# EAGLE design CD_brains (EAGLE 7.2.0)
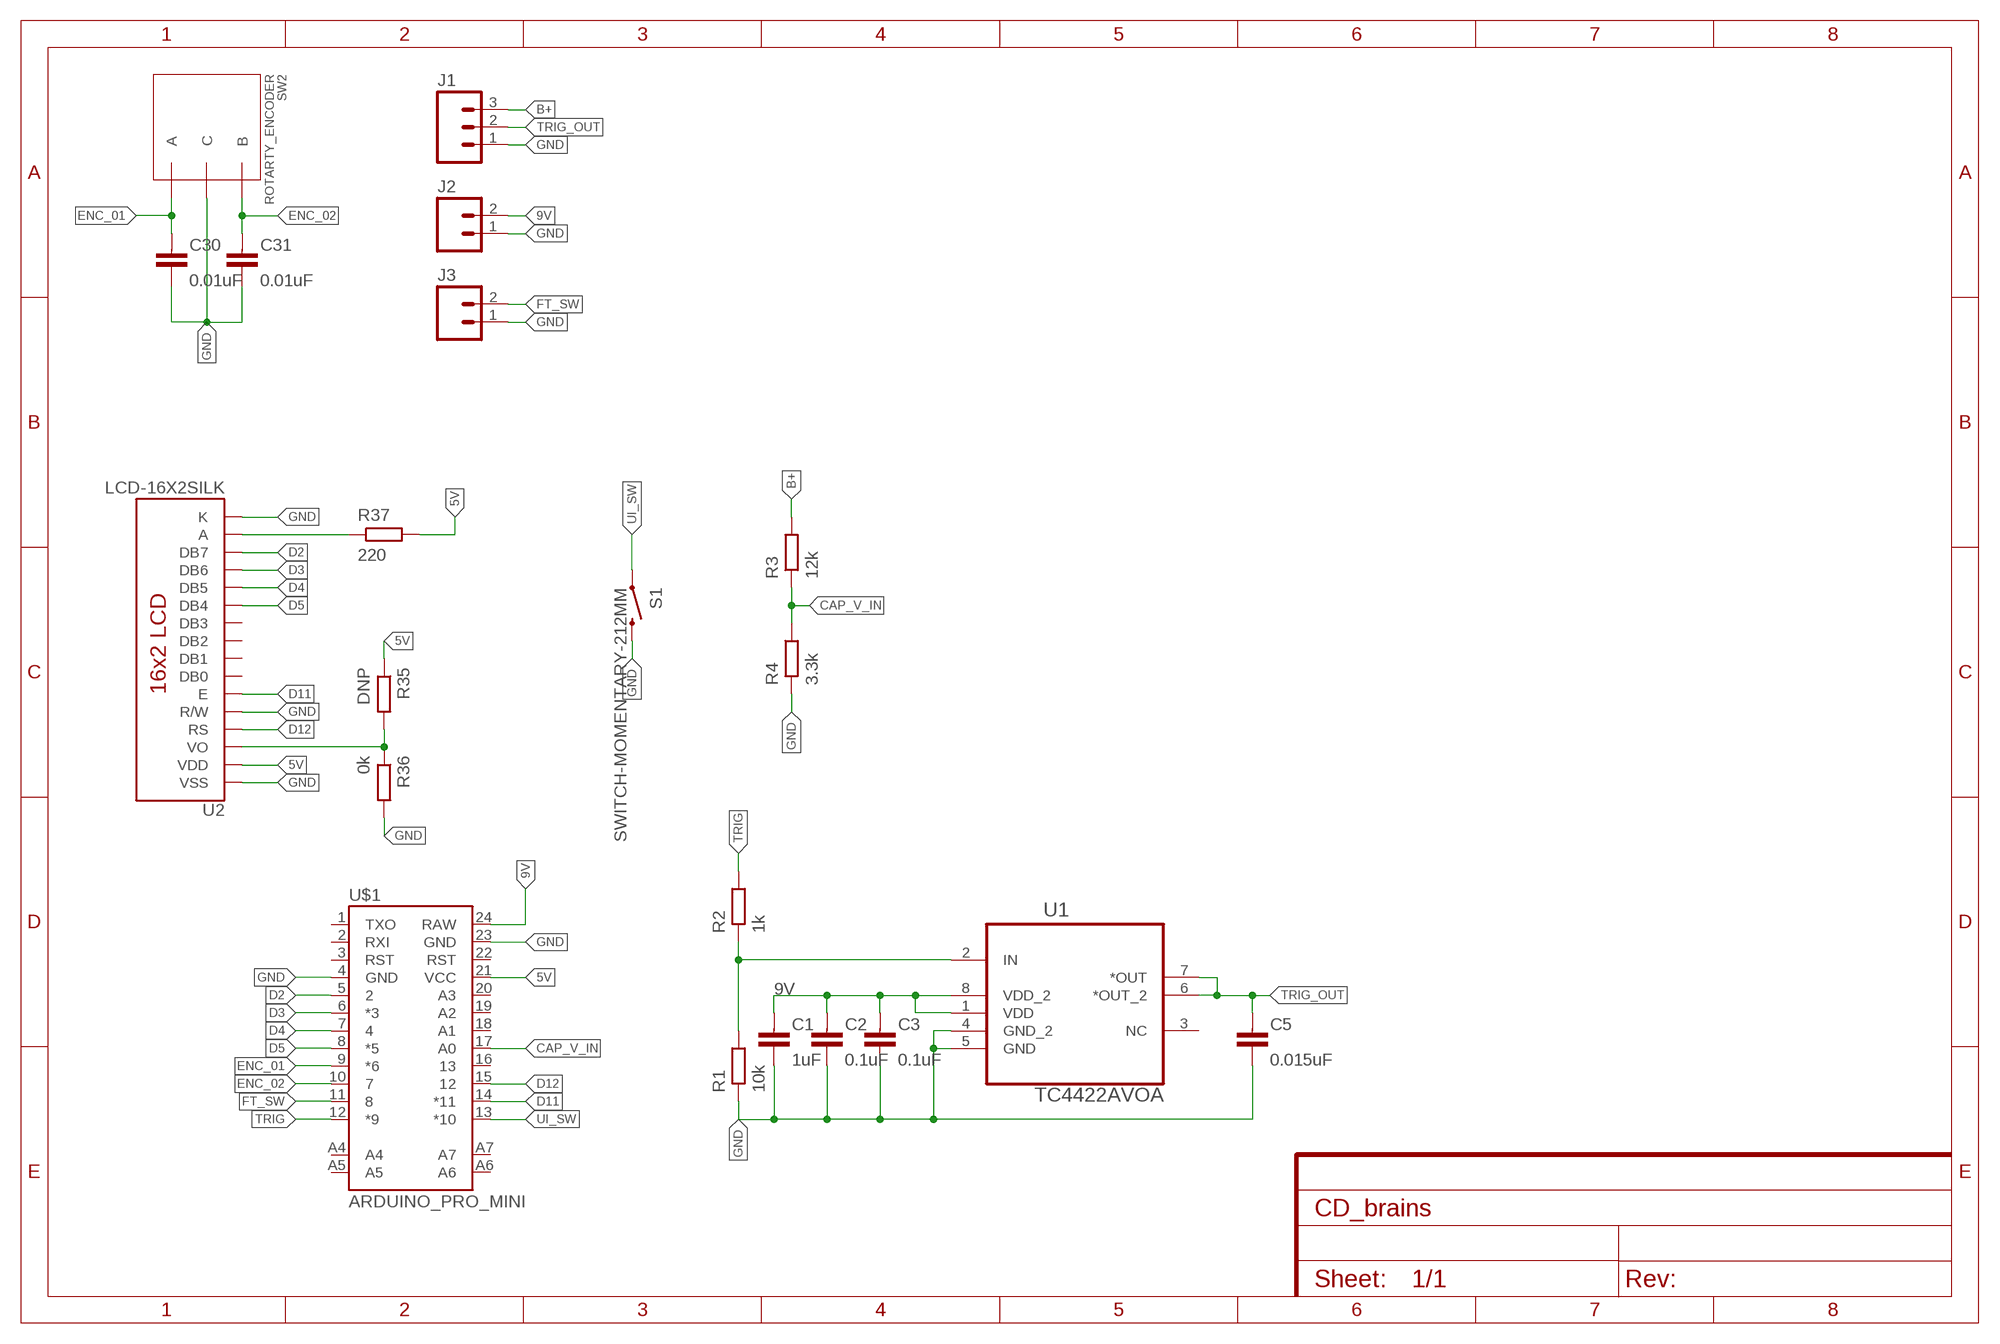
[diagram p0: schematic, sheet 1]

## Parts
C1  1uF  CAPACITOR0805-N  [C0805-N]
C2  0.1uF  CAPACITOR0603-N  [C0603-N]
C3  0.1uF  CAPACITOR0603-N  [C0603-N]
C5  0.015uF  CAPACITOR0603-N  [C0603-N]
C30  0.01uF  CAPACITOR0603-N  [C0603-N]
C31  0.01uF  CAPACITOR0603-N  [C0603-N]
J1  M03LOCK_NO_SILK  [1X03_LOCK_NO_SILK]
J2  M02LOCK  [1X02_LOCK]
J3  M02LOCK  [1X02_LOCK]
R1  10k  RESISTOR0603-N  [R0603-N]
R2  1k  RESISTOR0603-N  [R0603-N]
R3  12k  RESISTOR0603-N  [R0603-N]
R4  3.3k  RESISTOR0603-N  [R0603-N]
R35  DNP  RESISTOR0603-N  [R0603-N]
R36  0k  RESISTOR0603-N  [R0603-N]
R37  220  RESISTOR0603-N  [R0603-N]
S1  SWITCH-MOMENTARY-212MM  [TACTILE-PTH-12MM]
SW2  ROTARTY_ENCODER  [ROTARY_ENC_PLAIN]
U1  TC4422AVOA  [SOIC127P600X175-8N]
U2  LCD-16X2SILK  [LCD-16X2]
U$1  ARDUINO_PRO_MINI  [ARDUINO_PRO_MINI]

## Nets
5V: R35.1 R37.2 U2.2(VDD) U$1.21(VCC)
9V: C1.1 C2.1 C3.1 J2.2 U1.1(VDD) U1.8(VDD_2) U$1.24(RAW)
B+: J1.3 R3.2
CAP_V_IN: R3.1 R4.2 U$1.17(A0)
D2: U2.14(DB7) U$1.5
D3: U2.13(DB6) U$1.6(*3)
D4: U2.12(DB5) U$1.7
D5: U2.11(DB4) U$1.8(*5)
D11: U2.6(E) U$1.14(*11)
D12: U2.4(RS) U$1.15
ENC_01: C30.1 SW2.A U$1.9(*6)
ENC_02: C31.1 SW2.B U$1.10
FT_SW: J3.2 U$1.11
GND: C1.2 C2.2 C3.2 C5.2 C30.2 C31.2 J1.1 J2.1 J3.1 R1.1 R4.1 R36.2 S1.3 SW2.C U1.4(GND_2) U1.5(GND) U2.1(VSS) U2.5(R/W) U2.16(K) U$1.4(GND) U$1.23(GND)
N$3: R1.2 R2.1 U1.2(IN)
N$17: R37.1 U2.15(A)
N$28: R35.2 R36.1 U2.3(VO)
TRIG: R2.2 U$1.12(*9)
TRIG_OUT: C5.1 J1.2 U1.6(*OUT_2) U1.7(*OUT)
UI_SW: S1.1 U$1.13(*10)
Unconnected: U1.3(NC) U2.7(DB0) U2.8(DB1) U2.9(DB2) U2.10(DB3) U$1.1(TXO) U$1.2(RXI) U$1.3(RST) U$1.16 U$1.18(A1) U$1.19(A2) U$1.20(A3) U$1.22(RST) U$1.A4 U$1.A5 U$1.A6 U$1.A7

## Library data of the parts
C1-C3 C5 C30 C31 = passives-7351:CAPACITOR
J1 = SparkFun-Connectors:M03: Header 3 Standard 3-pin 0.1" header. Use with straight break away headers (SKU : PRT-00116), right angle break away headers (PRT-00553), swiss pins (PRT-00743), machine pins (PRT-00117), and female headers (PRT-00115). Molex polarized connector foot print use with SKU : PRT-08232 with associated crimp pins and housings.
J2 J3 = SparkFun-Connectors:M02: Standard 2-pin 0.1" header. Use with - straight break away headers ( PRT-00116) - right angle break away headers (PRT-00553) - swiss pins (PRT-00743) - machine pins (PRT-00117) - female headers (PRT-00115) Molex polarized connector foot print use with: PRT-08233 with associated crimp pins and housings. 2.54_SCREWTERM for use with PRT-10571. 3.5mm Screw Terminal footprints for PRT-08084 5mm Screw Terminal footprints for use with PRT-08432
R1-R4 R35-R37 = passives-7351:RESISTOR
S1 = SparkFun-Electromechanical:SWITCH-MOMENTARY-2: Various NO switches- pushbuttons, reed, etc; PROD_ID: SWCH-09185
SW2 = _my-parts:ROTARTY_ENCODER: Simple no LED rotary encoder Example: COM-09117
U1 = Microchip_By_element14_Batch_1:TC4422AVOA: DRIVER, MOSFET, SINGL 9A,; MPN: TC4422AVOA; OC_FARNELL: 1332306; OC_NEWARK: 22K2735; PACKAGE: 8 - SOIC; SUPPLIER: Microchip
U2 = SparkFun-Displays:LCD-16X2: Standard text-only 16x2 parallel input LCD
U$1 = _my-parts:ARDUINO_PRO_MINI

## Board
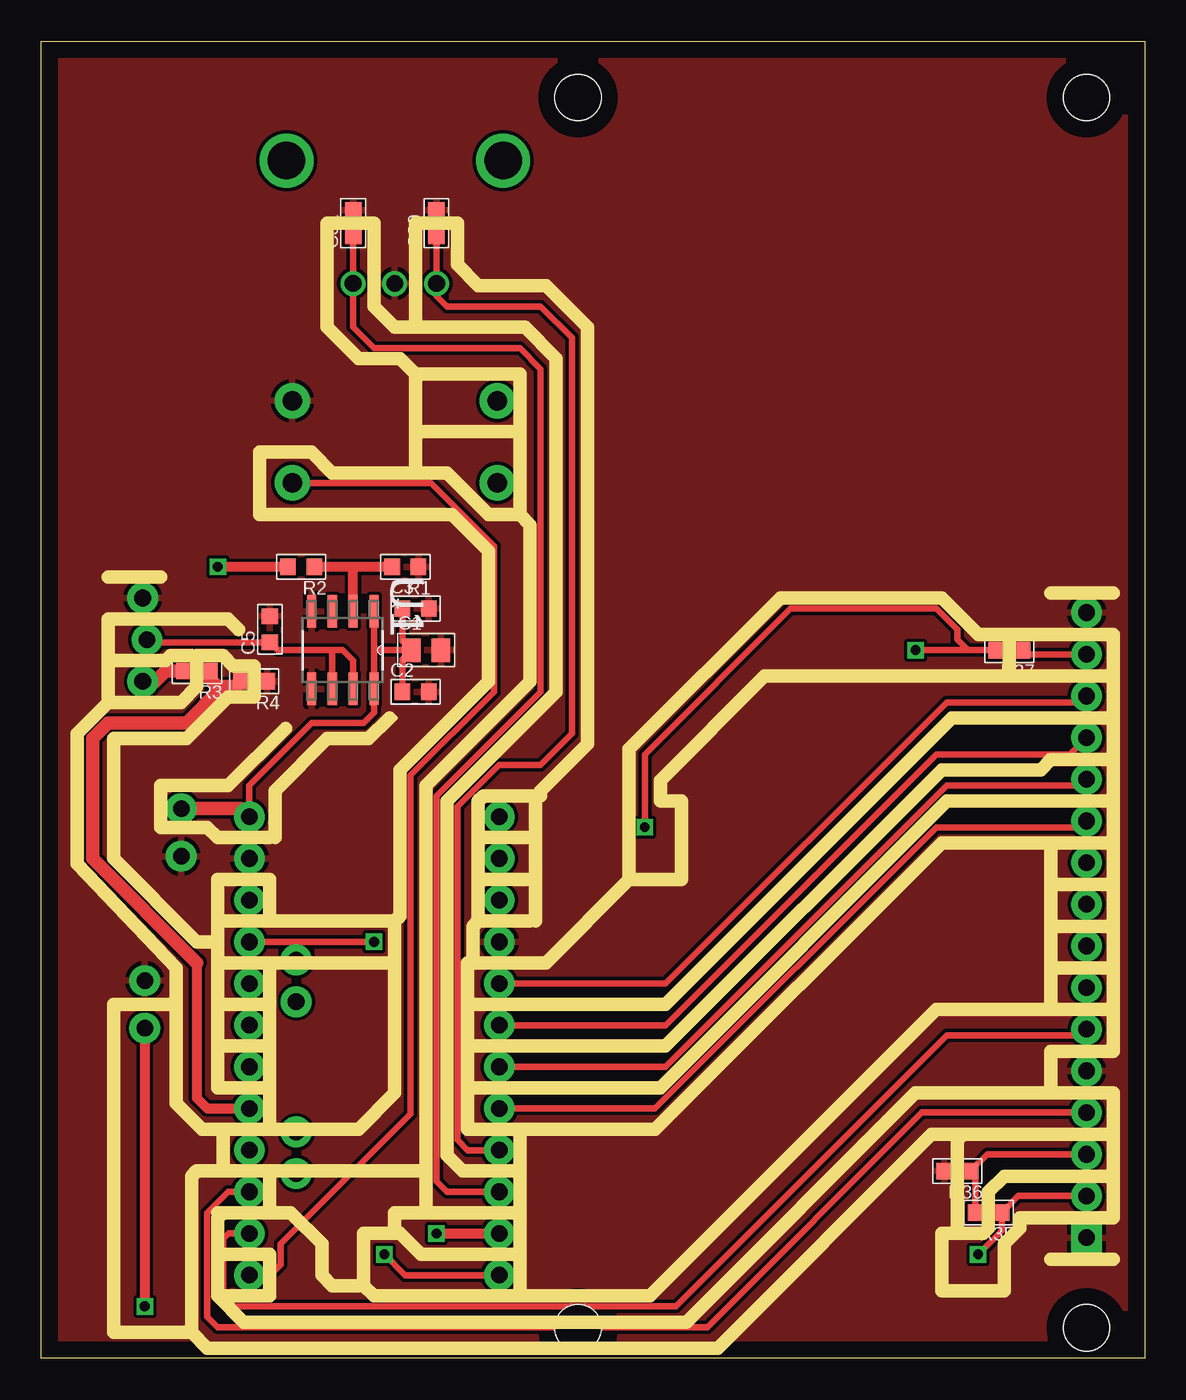
[diagram p1: board, top side]
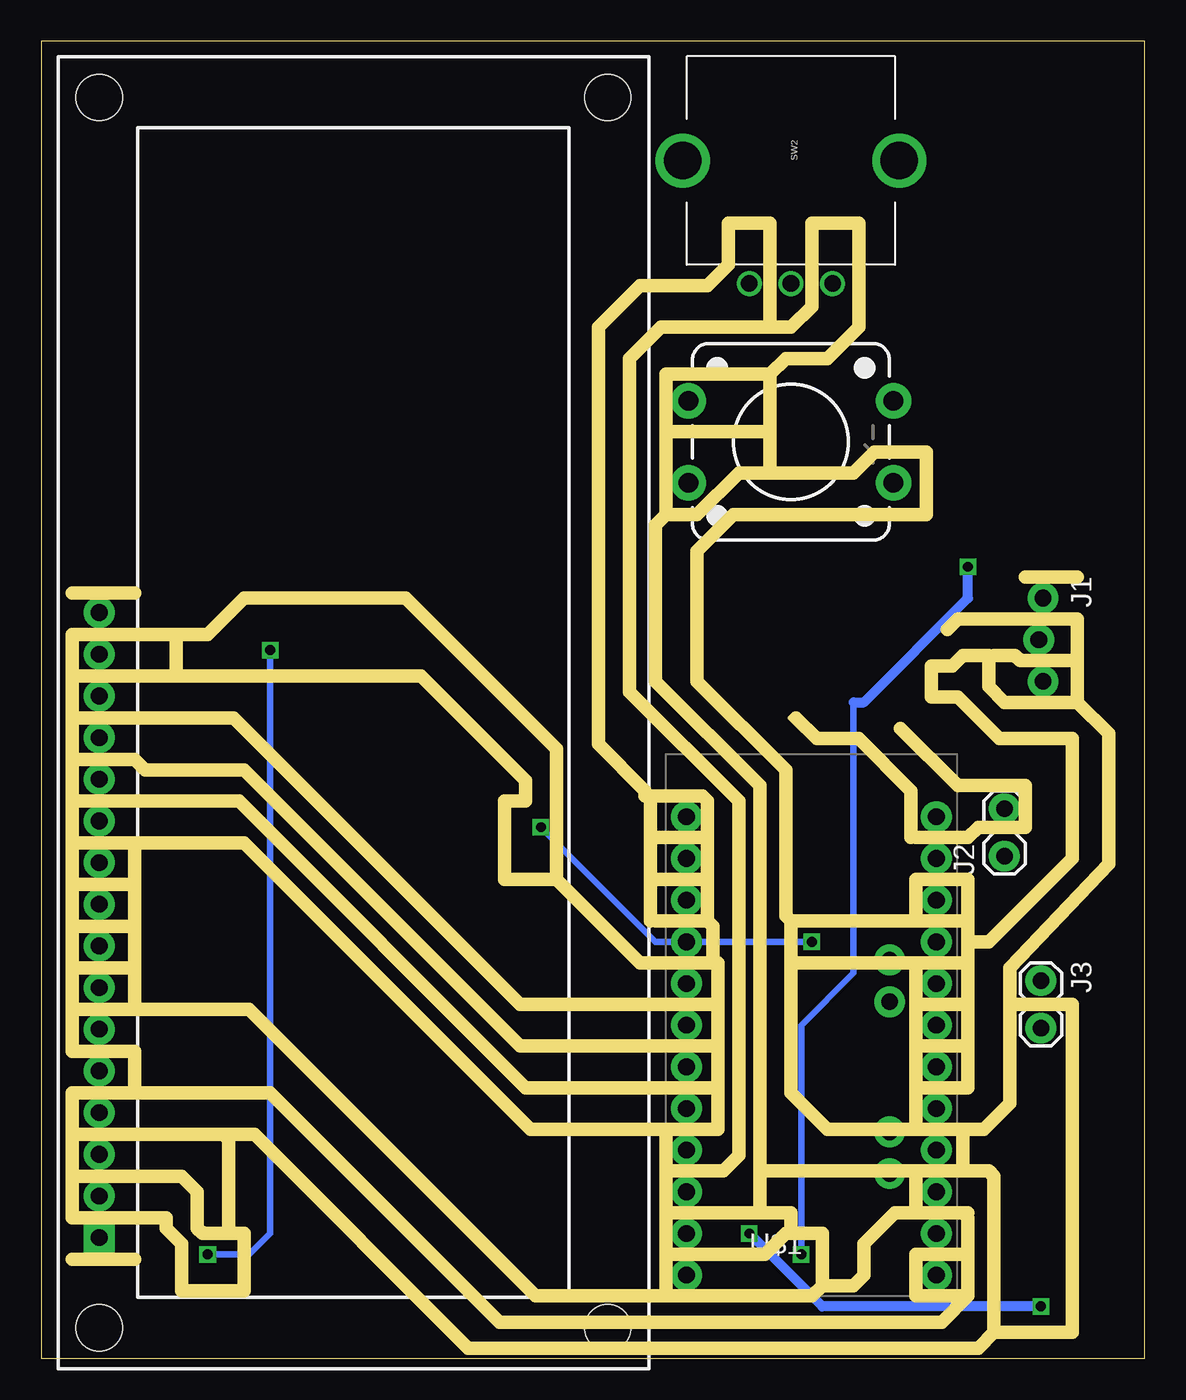
[diagram p2: board, bottom side, seen from below]

Size 67.29 x 80.31 mm. Coordinates in mm from the lower left corner, seen from the top.
Outline: 67.29,0 0,0 0,80.31 67.29,80.31 67.29,0
Copper layers (1*16): Top 0.035mm / dielectric 1.5mm / Bottom 0.035mm
Design rules "default": minimum track width 10mil, minimum drill 24mil, track to track 8mil, track to pad 8mil, pad to pad 8mil, via to via 8mil, smd to smd 8mil, copper to edge 40mil, drill to drill 8mil, minimum pad ring 10mil, minimum via ring 8mil, stop-mask expansion 4mil, vias tented up to drill 0mil, thermal gap 10mil
Milling: 218 lines

### Footprints (pad centres in the part's own frame; a part is rotated, then mirrored left to right if it is on the bottom)
C0805-N = smd 1.15 x 1.45: 1 -0.9,0; 2 0.9,0
C0603-N = smd 0.95 x 1: 1 -0.8,0; 2 0.8,0
1X03_LOCK_NO_SILK = drill 1.016 pad 1.88: 1 0,0.127; 2 2.54,-0.127; 3 5.08,0.127
1X02_LOCK = drill 1.016 pad 1.88: 1 -0.178,0; 2 2.718,0
R0603-N = smd 0.95 x 1: 1 -0.8,0; 2 0.8,0
TACTILE-PTH-12MM = drill 1.2 pad 2.159: 1 6.25,-2.5; 2 -6.25,-2.5; 3 6.25,2.5; 4 -6.25,2.5
ROTARY_ENC_PLAIN = drill 1.016: A 7.493,-2.54; B 7.493,2.54; C 7.493,0 | drill 2.286: P$3 0,6.604; P$4 0,-6.604
SOIC127P600X175-8N = smd 1.981 x 0.559: 1 -2.362,1.905; 2 -2.362,0.635; 3 -2.362,-0.635; 4 -2.362,-1.905; 5 2.362,-1.905; 6 2.362,-0.635; 7 2.362,0.635; 8 2.362,1.905
LCD-16X2 = drill 1.016 pad 1.88 square: 1 -32,15.5 | drill 1.016 pad 1.88: 2 -29.46,15.5; 3 -26.92,15.5; 4 -24.38,15.5; 5 -21.84,15.5; 6 -19.3,15.5; 7 -16.76,15.5; 8 -14.22,15.5; 9 -11.68,15.5; 10 -9.14,15.5; 11 -6.6,15.5; 12 -4.06,15.5; 13 -1.52,15.5; 14 1.02,15.5; 15 3.56,15.5; 16 6.1,15.5 | hole 2.8: -37.5,15.5; -37.5,-15.5; 37.5,15.5; 37.5,-15.5
ARDUINO_PRO_MINI = drill 1.016 pad 1.88: 1 -7.62,12.7; 2 -7.62,10.16; 3 -7.62,7.62; 4 -7.62,5.08; 5 -7.62,2.54; 6 -7.62,0; 7 -7.62,-2.54; 8 -7.62,-5.08; 9 -7.62,-7.62; 10 -7.62,-10.16; 11 -7.62,-12.7; 12 -7.62,-15.24; 13 7.62,-15.24; 14 7.62,-12.7; 15 7.62,-10.16; 16 7.62,-7.62; 17 7.62,-5.08; 18 7.62,-2.54; 19 7.62,0; 20 7.62,2.54; 21 7.62,5.08; 22 7.62,7.62; 23 7.62,10.16; 24 7.62,12.7; A4 4.763,1.429; A5 4.763,3.969; A6 4.763,-9.049; A7 4.763,-6.509

### Placement (x,y rotation side)
C1  23.48,43.18 0 top
C2  22.84,40.64 0 top
C3  22.84,45.72 0 top
C5  13.95,44.45 90 top
C30  24.11,69.22 90 top
C31  19.03,69.22 90 top
J1  6.33,46.35 270 bottom
J2  8.55,30.8 90 bottom
J3  6.33,22.86 270 bottom
R1  22.21,48.26 180 top
R2  15.86,48.26 180 top
R3  9.51,41.91 180 top
R4  13,41.27 180 top
R35  57.77,8.89 180 top
R36  55.86,11.43 180 top
R37  59.03,43.18 180 top
S1  21.57,55.88 0 bottom
SW2  21.57,73.03 270 bottom
U1  18.4,43.18 270 top
U2  48.24,39.37 90 bottom
U$1  20.32,20.32 0 bottom

### Tracks (layer width: path | path; a pad name or v marks a point on that pad's centre or on a via)
5V  (via drill 0.6)
  Top 0.406: U2.2 59.59,9.91 R35.1 58.57,7.79 v57.13,6.35 | v53.32,43.18 R37.2 56.5,43.18 55.86,43.81 55.86,44.45 54.59,45.72 45.7,45.72 36.81,36.83 v36.81,32.38 | v20.3,25.4 U$1.21 12.68,25.4
  Bottom 0.406: v57.13,6.35 54.59,6.35 53.32,7.62 v53.32,43.18 | v20.3,25.4 29.83,25.4 v36.81,32.38
9V
  Top 0.406: 20.3,43.18 U1.8 20.3,39.37 19.67,38.73 16.49,38.73 12.68,34.92 12.68,33.02 U$1.24 | C2.1 22.04,42.65 C1.1 | C3.1 22.04,43.72 C1.1 | U1.1 20.3,43.18 | 20.3,43.18 C1.1
  Top 0.813: J2.2 12.18,33.52 12.68,33.02
B+
  Top 0.813: J1.3 6.97,41.27 7.6,41.91 R3.2
CAP_V_IN
  Top 0.406: U$1.17 12.68,15.24
  Top 0.61: 12.68,15.24 10.14,15.24 9.51,15.88 9.51,24.13
  Top 0.813: 9.51,24.13 3.16,30.48 3.16,37.78 4.11,38.73 8.87,38.73 10.93,40.8 | 10.93,40.8 11.09,40.96 11.88,40.96 R4.2 | R3.1 10.31,41.43 10.93,40.8
D2
  Top 0.406: U2.14 63.36,40.01 55.23,40.01 38.08,22.86 U$1.5 27.92,22.86
D3
  Top 0.406: 27.92,20.32 U$1.6 28.26,20.32 38.08,20.32 54.59,36.83 62.72,36.83 U2.13
D4
  Top 0.406: U2.12 63.36,34.92 55.23,34.92 38.08,17.78 U$1.7 27.92,17.78
D5
  Top 0.406: 27.92,15.24 U$1.8 28.26,15.24 37.45,15.24 54.59,32.38 63.36,32.38 U2.11
D11
  Top 0.406: U2.6 63.36,19.68 55.23,19.68 38.72,3.17 11.75,3.17 11.11,3.81 11.11,7.3 11.43,7.62 U$1.14
D12
  Top 0.406: U2.4 53.71,14.99 40.62,1.91 10.78,1.91 10.14,2.54 10.14,8.89 11.41,10.16 U$1.15
ENC_01
  Top 0.406: C30.1 SW2.A 24.11,64.77 24.75,64.14 30.46,64.14 32.37,62.23 32.37,38.1 30.46,36.2 27.92,36.2 25.38,33.66 25.38,13.34 26.02,12.7 U$1.9
ENC_02
  Top 0.406: C31.1 SW2.B 19.03,62.87 20.3,61.59 29.19,61.59 30.46,60.33 30.46,40.64 24.11,34.29 24.11,10.79 24.75,10.16 U$1.10
FT_SW  (via drill 0.6)
  Top 0.406: 27.92,7.62 U$1.11
  Top 0.61: J3.2 v6.33,3.17 | v24.11,7.62 27.92,7.62
  Bottom 0.61: v6.33,3.17 19.67,3.17 v24.11,7.62
GND
  pour Top: 67.29,0 -0.02,0 -0.02,80.01 67.29,80.01
N$3
  Top 0.61: U1.2 19.03,48.26 | 19.03,48.26 R2.1 | R1.2 19.03,48.26
N$17
  Top 0.406: U2.15 60.09,42.93 R37.1
N$28
  Top 0.406: U2.3 57.68,12.45 R36.1 56.97,11.12 R35.2
TRIG  (via drill 0.6)
  Top 0.406: U$1.12 22.21,5.08 v20.94,6.35
  Top 0.61: R2.2 v10.78,48.26
  Bottom 0.406: v20.94,6.35 20.94,20.32 17.76,23.5 17.76,40.01
  Bottom 0.61: 17.76,40.01 17.13,40.01 10.78,46.35 v10.78,48.26
TRIG_OUT
  Top 0.406: U1.7 19.03,42.55 18.4,43.18 17.76,43.18 | 17.76,43.18 14.42,43.18 C5.1 6.67,43.65 J1.2 | U1.6 17.76,43.18
UI_SW
  Top 0.406: S1.1 23.77,53.38 27.62,49.53 27.62,40.64 22.54,35.56 22.54,14.92 14.61,6.99 14.61,5.71 13.97,5.08 U$1.13